# Altium schematic sheet ReboostV2_Bridge.SchDoc: Halfe Bridge
size 420 x 297 mm; SheetNumber: 3
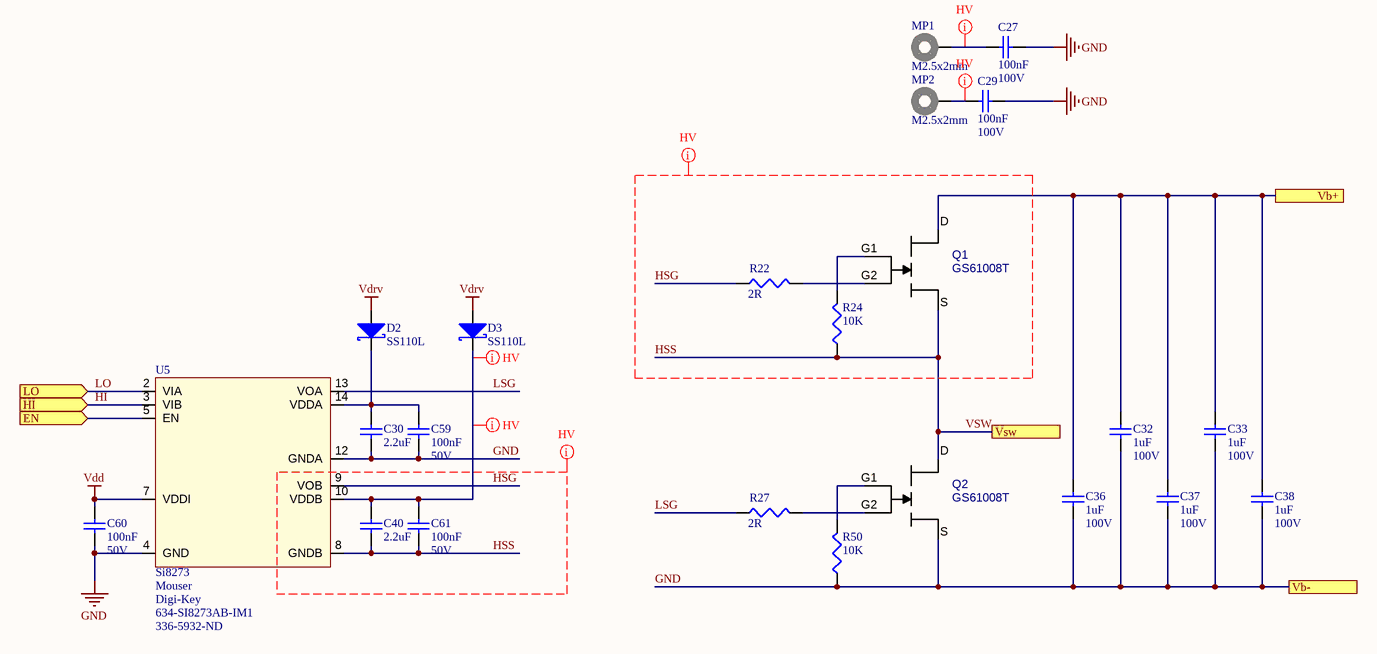
[diagram p0: ReboostV2_Bridge.SchDoc]

## Parts
C27  100nF  Voltage Rating: 100V  [C-0805]
C29  100nF  Voltage Rating: 100V  [C-0805]
C30  2.2uF  [C0603]
C32  1uF  Voltage Rating: 100V  [C-1206]
C33  1uF  Voltage Rating: 100V  [C-1206]
C36  1uF  Voltage Rating: 100V  [C-1206]
C37  1uF  Voltage Rating: 100V  [C-1206]
C38  1uF  Voltage Rating: 100V  [C-1206]
C40  2.2uF  [C0603]
C59  100nF  Voltage Rating: 50V  [C0603]
C60  100nF  Voltage Rating: 50V  [C0603]
C61  100nF  Voltage Rating: 50V  [C0603]
D2  SS110L  [SUB-SMA]
D3  SS110L  [SUB-SMA]
MP1  M2.5x2mm  [9774020151]
MP2  M2.5x2mm  [9774020151]
Q1  GS61008T  [GS61008T]
Q2  GS61008T  [GS61008T]
R22  2R  [0603]
R24  10K  [0603]
R27  2R  [0603]
R50  10K  [0603]
U5  Si8273  Supplier 1: Mouser  Supplier 2: Digi-Key  Supplier Part Number 1: 634-SI8273AB-IM1  Supplier Part Number 2: 336-5932-ND  [DFN-14]

## Ports
EN (in), HI (in), LO (in), Vb+, Vb-, Vsw

## Nets
GND: C27.1 C29.1 C30.1 C32.1 C33.1 C36.1 C37.1 C38.1 C59.1 C60.1 Q2.S R50.1 U5.4(GND) U5.12(GNDA) ; port Vb-
Vdd: C60.2 U5.7(VDDI)
Vdrv: D2.1(A) D3.1(A)
EN: U5.5(EN) ; port EN
HI: U5.3(VIB) ; port HI
HSG: R22.1 U5.9(VOB)
HSS: C40.1 C61.1 Q1.S Q2.D R24.1 U5.8(GNDB) ; port Vsw  [also labelled VSW]
LO: U5.2(VIA) ; port LO
LSG: R27.1 U5.13(VOA)
Vb+: C32.2 C33.2 C36.2 C37.2 C38.2 Q1.D ; port Vb+
NetC27_2: C27.2 MP1.1
NetC29_2: C29.2 MP2.1
NetC30_2: C30.2 C59.2 D2.2(K) U5.14(VDDA)
NetC40_2: C40.2 C61.2 D3.2(K) U5.10(VDDB)
NetQ1_G1: Q1.G1 R24.2
NetQ1_G2: Q1.G2 R22.2
NetQ2_G1: Q2.G1 R50.2
NetQ2_G2: Q2.G2 R27.2

## Layout directives
net class HV: HSG, HSS, NetC27_2, NetC29_2, NetC40_2

## Notes on the sheet
- PROJECT
- www.tpee.nl <http://www.tpee.nl>
- TITLE
- FILE NAME
- A3
- SIZE
- Author:
- SHEET
- OF

## Library data of the parts
C27 C29 = 100nF/0805/CER/100V: Capacitor, 100nF, 100V, X7R; Capacitance Tolerance: ± 10%; Capacitor Case Style: 0805; Brand Number: C0805C104K1RACTU; Brand: KEMET; Dielectric Characteristic: X7R; Capacitance: 100nF; Temperature Range: -55°C to +125°C; Price: 0,096; Order Code Supplier: 1650862; Supplier: Farnell; Manufacturer: KEMET; Manufacturer Part Number: C0805C104K1RACTU
C30 C40 = 2.2uF/0603/CER/16V: Capacitor, 2.2uF, 16V, X5R; Capacitance Tolerance: +/- 10%; Capacitor Case Style: 0603; Brand Number: GRM188R61C225KE15D; Brand: MURATA; Dielectric Characteristic: X5R; Capacitance: 2.2uF; Temperature Range: -55°C to 85°C; Price: 0,077; Order Code Supplier: 1735526; Supplier: Farnell; Voltage Rating: 16V; Manufacturer: MURATA; Manufacturer Part Number: GRM188R61C225KE15D
C32 C33 C36-C38 = 1uF/1206/CER/100V: Capacitor, 1uF, 100V, X7R; Capacitance Tolerance: ± 10%; Capacitor Case Style: 1206; Brand Number: 12061C105K4Z2A; Brand: AVX; Dielectric Characteristic: X7R; Capacitance: 1uF; Temperature Range: -55°C to +125°C; Price: 0,52; Order Code Supplier: 1833855; Supplier: Farnell; Manufacturer: AVX; Manufacturer Part Number: 12061C105K4Z2A
C59-C61 = 100nF/0603/CER/50V: Capacitor, 100nF, 50V, X7R; Capacitance Tolerance: ± 10%; Capacitor Case Style: 0603; Brand Number: MCCA000255; Brand: MULTICOMP; Dielectric Characteristic: X7R; Capacitance: 100nF; Temperature Range: -55°C to +125°C; Price: 0,008; Order Code Supplier: 1759122RL; Supplier: Farnell; Manufacturer: MULTICOMP; Manufacturer Part Number: MCCA000255
D2 D3 = SS110L: Diode Schottky, Vrrm: 100V, If: 1A, Vf: 0.9V; Manufacturer: TAIWAN SEMICONDUCTOR; Manufacturer Part Number: SS110L R3; Case Style: SMF; Forward Current: 1A; Forward Voltage: 0.9V; Order Code Supplier: 1559156; Price: 0,191; Supplier: Farnell; Temperature Range: -55°C to +150°C; Vrrm: 100V; MPN: SS110L
MP1 MP2 = 9774020151: WA-SMSI SMT Steel Spacer, M2.5 Thread Internal, OD 5.1mm, M2.5x2mm; Manufacturer: Wurth Elektronik; Inner Diameter: 3.5mm; Surface: Tin; ComponentLink1Description: Manufacturer; ComponentLink1URL: http://www.we-online.de; ComponentLink2Description: Datasheet; ComponentLink2URL: https://www.we-online.com/catalog/datasheet/9774020151.pdf; Mounting Technology: SMT; Packaging: Bulk; Manufacturer Part Number: 9774020151; Length: 2mm; Inner Thread Length: -; Operating Temperature: -55 to +150degC; Outer Diameter: 5.1mm; Published Date: April 2020; Material: Steel; Thread: M2.5
Q1 Q2 = GS61008T: GAN TRANS E-MODE 100V 90A TOP SIDE COOL; Manufacturer: GaN Systems; Manufacturer Part Number: GS61008T
R22 R27 = 2/0603/0100W/75V: Resistor, 2R, 5%, 0.1W, 75V, 200PPM, 0603; Brand: PANASONIC; Brand Number: ERJ3GEYJ2R0V; Case Style: 0603; Order Code Supplier: 2059531; Power Rating: 0.1W; Price: 0,009; Resistance: 2R; Supplier: Farnell; Temperature Coefficient: ± 200PPM; Temperature Range: -55°C to +125°C; Voltage Rating: 75V; Manufacturer: PANASONIC; Manufacturer Part Number: ERJ3GEYJ2R0V
R24 R50 = 10K/0603/0063W/50V: Resistor, 10K, 1%, 0.063W, 50V, 100PPM, 0603; Brand: VISHAY DRALORIC; Brand Number: CRCW060310K0FKEA; Case Style: 0603; Order Code Supplier: 2122493; Power Rating: 0.063W; Price: 0,038; Resistance: 10K; Supplier: Farnell; Temperature Coefficient: ± 100PPM; Temperature Range: -55°C to +125°C; Voltage Rating: 50V; Manufacturer: VISHAY DRALORIC; Manufacturer Part Number: CRCW060310K0FKEA
U5 = Si8273ABIM1: 4 Amp ISOdriver with High Transient (dV/dt) Immunity; Manufacturer: Skyworks Solutions Inc.; MPN: SI8273AB-IM1; Manufacturer Part Number: SI8273AB-IM1